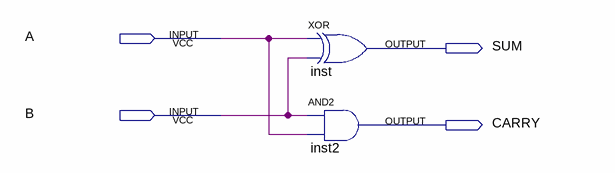
[diagram p0: schematic sheet]
// Quartus schematic half_add.bdf as structural Verilog: 2 symbols, 4 pins
module half_add (
  input  A,
  input  B,
  output SUM,
  output CARRY
);

  xor inst (SUM, A, B);
  and inst2 (CARRY, B, A);
endmodule
